# Altium schematic sheet 开关电源v0.01.SchDoc
size A4
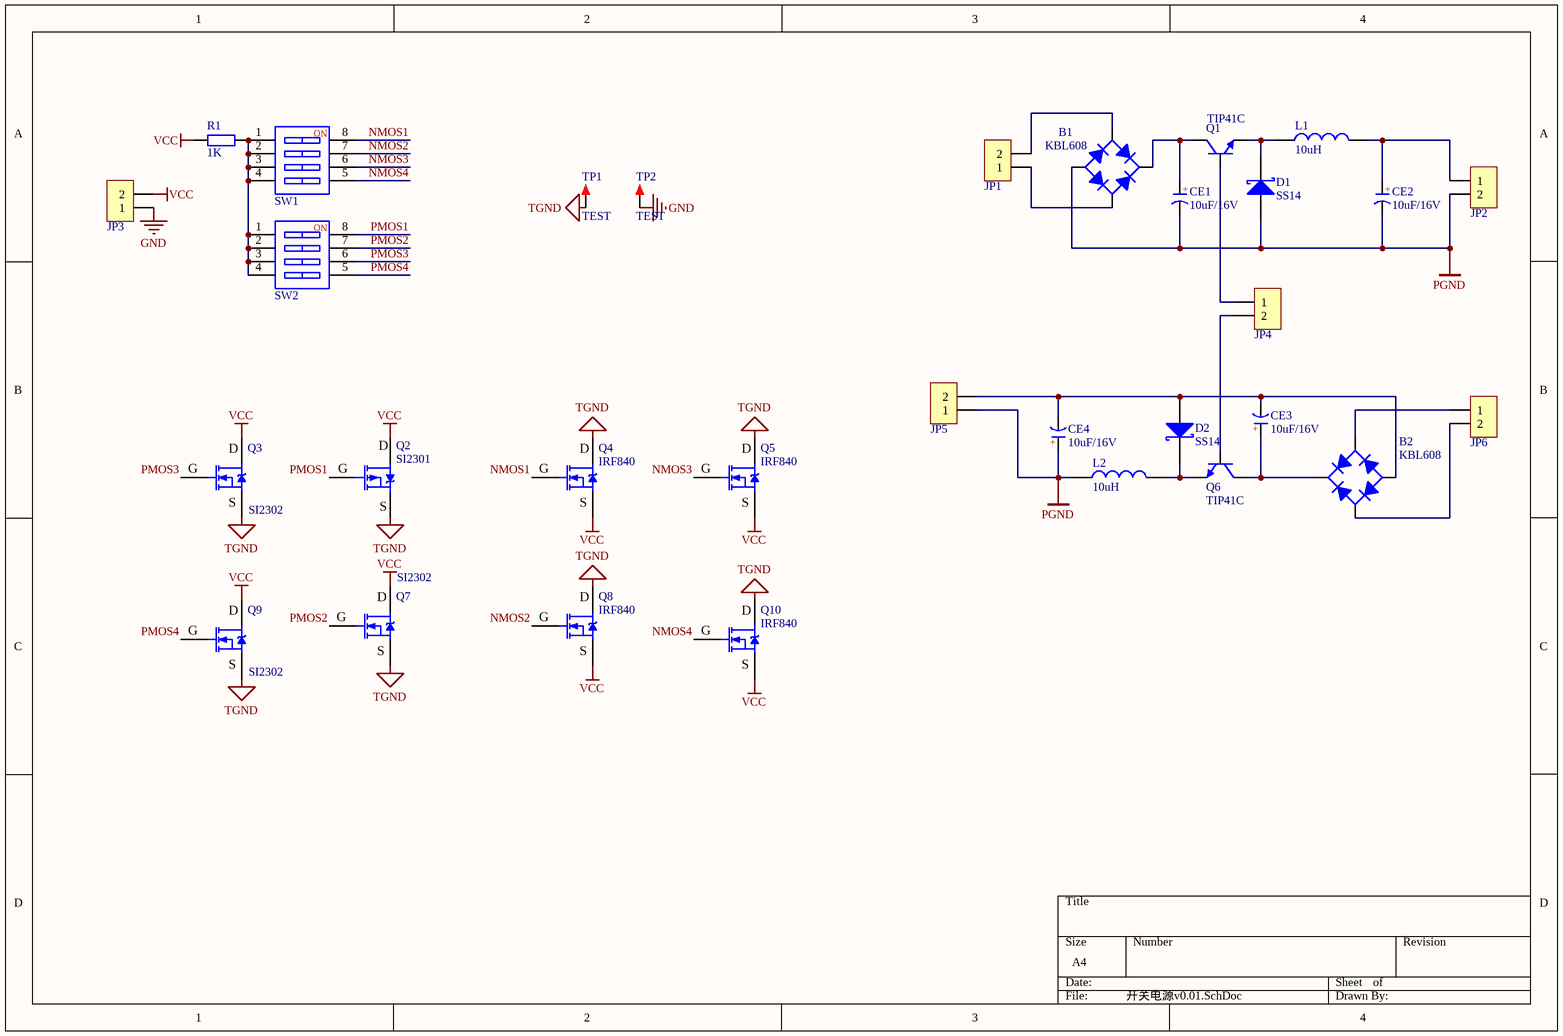
[diagram p0: 开关电源v0.01.SchDoc]

## Parts
B1  KBL608  [KBP]
B2  KBL608  [KBP]
CE1  10uF/16V  [CAP 3.5*8*11.5 - BK]
CE2  10uF/16V  [CAP 3.5*8*11.5 - BK]
CE3  10uF/16V  [CAP 3.5*8*11.5 - BK]
CE4  10uF/16V  [CAP 3.5*8*11.5 - BK]
D1  SS14  [DO-201AD]
D2  SS14  [DO-201AD]
JP1  HDR-1X2  [KF7620-2P]  (value not drawn)
JP2  HDR-1X2  [KF7620-2P]  (value not drawn)
JP3  HDR-1X2  [KF7620-2P]  (value not drawn)
JP4  HDR-1X2  [HDR2.54-LI-2P]  (value not drawn)
JP5  HDR-1X2  [KF7620-2P]  (value not drawn)
JP6  HDR-1X2  [KF7620-2P]  (value not drawn)
L1  10uH  [AL0410_V]
L2  10uH  [AL0410_V]
Q1  TIP41C  [TO220A]
Q2  SI2301  [SOT23-3M]
Q3  SI2302  [TO220A]
Q4  IRF840  [SOT23-3M]
Q5  IRF840  [TO220A]
Q6  TIP41C  [TO220A]
Q7  SI2302  [SOT23-3M]
Q8  IRF840  [SOT23-3M]
Q9  SI2302  [TO220A]
Q10  IRF840  [TO220A]
R1  1K  [RS 1/2W]
SW1  SW-4P  [CSW DIP-4P]  (value not drawn)
SW2  SW-4P  [CSW DIP-4P]  (value not drawn)
TP1  TEST  [TEST 1]
TP2  TEST  [TEST 1]

## Nets
GND: JP3.1 TP2.1
PGND: B1.DC- CE1.2(K) CE2.2(K) CE4.1(A) D1.1(A) JP2.2 JP5.1 L2.1
TGND: Q2.2(S) Q3.2(S) Q4.2(D) Q5.2(D) Q7.2(S) Q8.2(D) Q9.2(S) Q10.2(D) TP1.1
VCC: JP3.2 Q2.3(D) Q3.3(D) Q4.3(S) Q5.3(S) Q7.3(D) Q8.3(S) Q9.3(D) Q10.3(S) R1.1
NMOS1: Q4.1(G) SW1.8
NMOS2: Q8.1(G) SW1.7
NMOS3: Q5.1(G) SW1.6
NMOS4: Q10.1(G) SW1.5
PMOS1: Q2.1(G) SW2.8
PMOS2: Q7.1(G) SW2.7
PMOS3: Q3.1(G) SW2.6
PMOS4: Q9.1(G) SW2.5
NetB1_AC1: B1.AC1 JP1.2
NetB1_AC2: B1.AC2 JP1.1
NetB1_DC+: B1.DC+ CE1.1(A) Q1.2(C)
NetB2_AC1: B2.AC1 JP6.2
NetB2_AC2: B2.AC2 JP6.1
NetB2_DC+: B2.DC+ CE3.1(A) Q6.2(C)
NetB2_DC-: B2.DC- CE3.2(K) CE4.2(K) D2.1(A) JP5.2
NetCE2_1: CE2.1(A) JP2.1 L1.2
NetD1_2: D1.2(K) L1.1 Q1.3(E)
NetD2_2: D2.2(K) L2.2 Q6.3(E)
NetJP4_1: JP4.1 Q1.1(B)
NetJP4_2: JP4.2 Q6.1(B)
NetR1_2: R1.2 SW1.1 SW1.2 SW1.3 SW1.4 SW2.1 SW2.2 SW2.3 SW2.4

## Notes on the sheet
- (in symbol CE) +
- (in symbol SW-4P) NO

## Library data of the parts
B1 B2 = KBL: 600V/8A整流桥; BOM名称: 1KV/2A整流桥; 版权归属: 封装库来自淘宝卖家 ID：黄晶宝石; 学习资源: https://shop463601444.taobao.com
CE1-CE4 = CE: 直插电解电容; 淘宝ID: 封装库来自淘宝 ID：黄晶宝石; BOM名称: 直插电解电容; 联系售后: https://shop463601444.taobao.com
D1 D2 = SS14: 肖特基二极管; 属性: 40V/1A; BOM名称: 肖特基二极管; 封装库来自淘宝 ID：黄晶宝石: https://shop463601444.taobao.com
JP1-JP6 = Header 2: 2P接插件; 版权归属: 封装库来自淘宝 ID：黄晶宝石; BOM名称: 2P接插件; 联系售后: https://shop463601444.taobao.com
L1 L2 = L: 小功率贴片电感; 淘宝ID: 封装库来自淘宝 ID：黄晶宝石; 封装库来自淘宝卖家 ID：黄晶宝石: 其他店铺购入均为盗版，不享受售后技术支持服务，请立即申请退款; BOM名称: 小功率贴片电感; 联系售后: https://shop463601444.taobao.com
Q1 Q6 = TIP41C: 互补功率-NPN型; 联系售后: 封装库来自淘宝 ID：黄晶宝石; 属性: 100V 6A 65W; BOM名称: 互补功率-NPN型; 技术支持，联系售后: https://shop463601444.taobao.com
Q2 = SI2301: P沟道场效应管; 技术支持，联系售后: 封装库来自淘宝 ID：黄晶宝石; BOM名称: P沟道场效应管; 学习资源: https://shop463601444.taobao.com
Q3 Q7 Q9 = SI2302: N沟道场效应管; 技术支持，联系售后: 封装库来自淘宝 ID：黄晶宝石; BOM名称: N沟道场效应管; 学习资源: https://shop463601444.taobao.com
Q4 Q5 Q8 Q10 = IRF840: N沟场效应管; BOM名称: N沟场效应管; 技术支持，联系售后: https://shop463601444.taobao.com
R1 = R-S: 色环电阻; 版权归属: 封装库来自淘宝 ID：黄晶宝石; BOM名称: 色环电阻; 联系售后: https://shop463601444.taobao.com
SW1 SW2 = SW-4P: 4路编码开关; 淘宝ID: 封装库来自淘宝 ID：黄晶宝石; BOM名称: 4路编码开关; 学习资源: https://shop463601444.taobao.com
TP1 TP2 = TEST: 测试点; 版权归属: 封装库来自淘宝 ID：黄晶宝石; BOM名称: 测试点; 学习资源: https://shop463601444.taobao.com